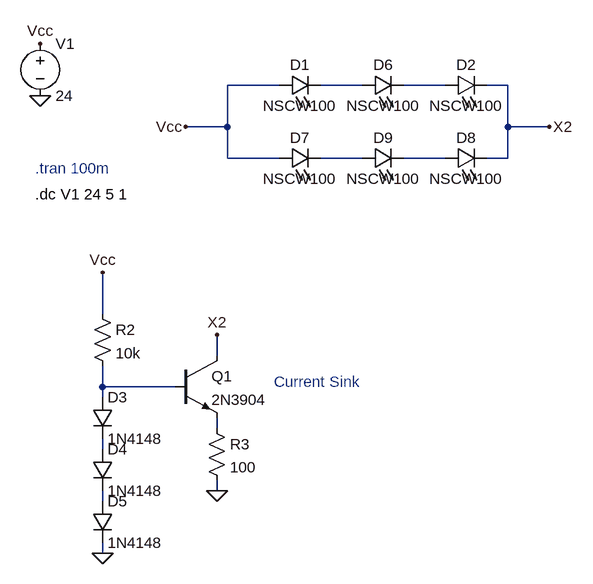
[diagram p0: schematic cc_driver_led.asc]
cc_driver_led.asc, the LTspice schematic file:
Version 4
SHEET 1 3836 1956
WIRE 816 656 736 656
WIRE 944 656 880 656
WIRE 1072 656 1008 656
WIRE 1168 656 1136 656
WIRE 736 720 736 656
WIRE 736 720 672 720
WIRE 1168 720 1168 656
WIRE 1232 720 1168 720
WIRE 736 768 736 720
WIRE 816 768 736 768
WIRE 944 768 880 768
WIRE 1072 768 1008 768
WIRE 1168 768 1168 720
WIRE 1168 768 1136 768
WIRE 544 1008 544 944
WIRE 720 1072 720 1040
WIRE 544 1120 544 1088
WIRE 656 1120 544 1120
WIRE 544 1136 544 1120
WIRE 720 1184 720 1168
WIRE 544 1216 544 1200
WIRE 720 1280 720 1264
WIRE 544 1296 544 1280
WIRE 544 1376 544 1360
FLAG 448 672 0
FLAG 448 592 Vcc
FLAG 1232 720 X2
FLAG 544 1376 0
FLAG 720 1280 0
FLAG 672 720 Vcc
FLAG 544 944 Vcc
FLAG 720 1040 X2
SYMBOL voltage 448 576 R0
WINDOW 123 0 0 Left 0
WINDOW 39 0 0 Left 0
SYMATTR InstName V1
SYMATTR Value 24
SYMBOL LED 816 672 R270
WINDOW 0 32 32 VTop 2
WINDOW 3 0 32 VBottom 2
SYMATTR InstName D1
SYMATTR Value NSCW100
SYMATTR Description Diode
SYMATTR Type diode
SYMBOL LED 1072 672 R270
WINDOW 0 32 32 VTop 2
WINDOW 3 0 32 VBottom 2
SYMATTR InstName D2
SYMATTR Value NSCW100
SYMATTR Description Diode
SYMATTR Type diode
SYMBOL npn 656 1072 R0
SYMATTR InstName Q1
SYMATTR Value 2N3904
SYMBOL res 528 992 R0
SYMATTR InstName R2
SYMATTR Value 10k
SYMBOL diode 528 1136 R0
SYMATTR InstName D3
SYMATTR Value 1N4148
SYMBOL diode 528 1216 R0
SYMATTR InstName D4
SYMATTR Value 1N4148
SYMBOL res 704 1168 R0
SYMATTR InstName R3
SYMATTR Value 100
SYMBOL diode 528 1296 R0
SYMATTR InstName D5
SYMATTR Value 1N4148
SYMBOL LED 944 672 R270
WINDOW 0 32 32 VTop 2
WINDOW 3 0 32 VBottom 2
SYMATTR InstName D6
SYMATTR Value NSCW100
SYMATTR Description Diode
SYMATTR Type diode
SYMBOL LED 816 784 R270
WINDOW 0 32 32 VTop 2
WINDOW 3 0 32 VBottom 2
SYMATTR InstName D7
SYMATTR Value NSCW100
SYMATTR Description Diode
SYMATTR Type diode
SYMBOL LED 1072 784 R270
WINDOW 0 32 32 VTop 2
WINDOW 3 0 32 VBottom 2
SYMATTR InstName D8
SYMATTR Value NSCW100
SYMATTR Description Diode
SYMATTR Type diode
SYMBOL LED 944 784 R270
WINDOW 0 32 32 VTop 2
WINDOW 3 0 32 VBottom 2
SYMATTR InstName D9
SYMATTR Value NSCW100
SYMATTR Description Diode
SYMATTR Type diode
TEXT 808 1112 Left 2 ;Current Sink
TEXT 440 784 Left 2 ;.tran 100m
TEXT 440 824 Left 2 !.dc V1 24 5 1

The netlist it stands for:
* cc_driver_led.asc
V1 Vcc 0 24
D1 Vcc N001 NSCW100
D2 N002 X2 NSCW100
Q1 X2 N005 N006 0 2N3904
R2 Vcc N005 10k
D3 N005 N007 1N4148
D4 N007 N008 1N4148
R3 N006 0 100
D5 N008 0 1N4148
D6 N001 N002 NSCW100
D7 Vcc N003 NSCW100
D8 N004 X2 NSCW100
D9 N003 N004 NSCW100
.model D D
.lib standard.dio
.model NPN NPN
.model PNP PNP
.lib standard.bjt
* Current Sink
* .tran 100m
.dc V1 24 5 1
.backanno
.end